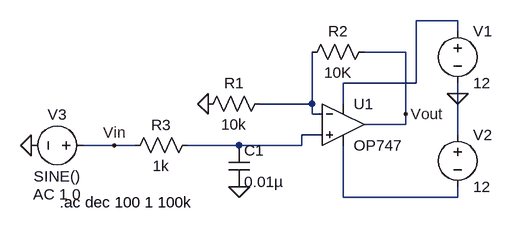
[diagram p0: schematic FO_ACTIVE_LPF.asc]
FO_ACTIVE_LPF.asc, the LTspice schematic file:
Version 4
SHEET 1 880 680
WIRE 336 -32 272 -32
WIRE 336 -16 336 -32
WIRE 256 16 192 16
WIRE 272 64 272 -32
WIRE 272 64 160 64
WIRE 336 80 336 64
WIRE 112 96 112 16
WIRE 112 96 32 96
WIRE 160 96 160 64
WIRE 112 112 112 96
WIRE 128 112 112 112
WIRE 256 112 256 16
WIRE 256 128 256 112
WIRE 256 128 192 128
WIRE 128 144 96 144
WIRE 336 144 336 80
WIRE -192 160 -240 160
WIRE -160 160 -192 160
WIRE 0 160 -80 160
WIRE 96 160 96 144
WIRE 96 160 0 160
WIRE 160 240 160 160
WIRE 336 240 336 224
WIRE 336 240 160 240
FLAG -48 96 0
FLAG 336 80 0
FLAG 0 224 0
FLAG -320 160 0
FLAG 256 112 Vout
FLAG -192 160 Vin
SYMBOL OpAmps\\OP747 160 64 R0
SYMATTR InstName U1
SYMBOL voltage 336 -32 R0
WINDOW 123 0 0 Left 0
WINDOW 39 0 0 Left 0
SYMATTR InstName V1
SYMATTR Value 12
SYMBOL voltage 336 128 R0
WINDOW 123 0 0 Left 0
WINDOW 39 0 0 Left 0
SYMATTR InstName V2
SYMATTR Value 12
SYMBOL res 48 80 R90
WINDOW 0 0 56 VBottom 2
WINDOW 3 32 56 VTop 2
SYMATTR InstName R1
SYMATTR Value 10k
SYMBOL res 208 0 R90
WINDOW 0 0 56 VBottom 2
WINDOW 3 32 56 VTop 2
SYMATTR InstName R2
SYMATTR Value 10K
SYMBOL res -64 144 R90
WINDOW 0 0 56 VBottom 2
WINDOW 3 32 56 VTop 2
SYMATTR InstName R3
SYMATTR Value 1k
SYMBOL cap -16 160 R0
SYMATTR InstName C1
SYMATTR Value 0.01µ
SYMBOL voltage -224 160 R90
WINDOW 0 -32 56 VBottom 2
WINDOW 3 32 56 VTop 2
WINDOW 123 60 56 VTop 2
WINDOW 39 0 0 Left 0
SYMATTR InstName V3
SYMATTR Value SINE()
SYMATTR Value2 AC 1 0
TEXT -276 248 Left 2 !.ac dec 100 1 100k

The netlist it stands for:
* FO_ACTIVE_LPF.asc
XU1 N003 N002 N001 N004 Vout OP747  ; pins In+ In- V+ V- OUT
V1 N001 0 12
V2 0 N004 12
R1 N002 0 10k
R2 Vout N002 10K
R3 N003 Vin 1k
C1 N003 0 0.01µ
V3 Vin 0 SINE() AC 1 0
.ac dec 100 1 100k
.backanno
.end